# Altium schematic sheet 03.Schematic.SchDoc: Schematic Page
size A3; DrawnBy: My My; Revision: 1.1; SheetNumber: 3; SheetTotal: 4
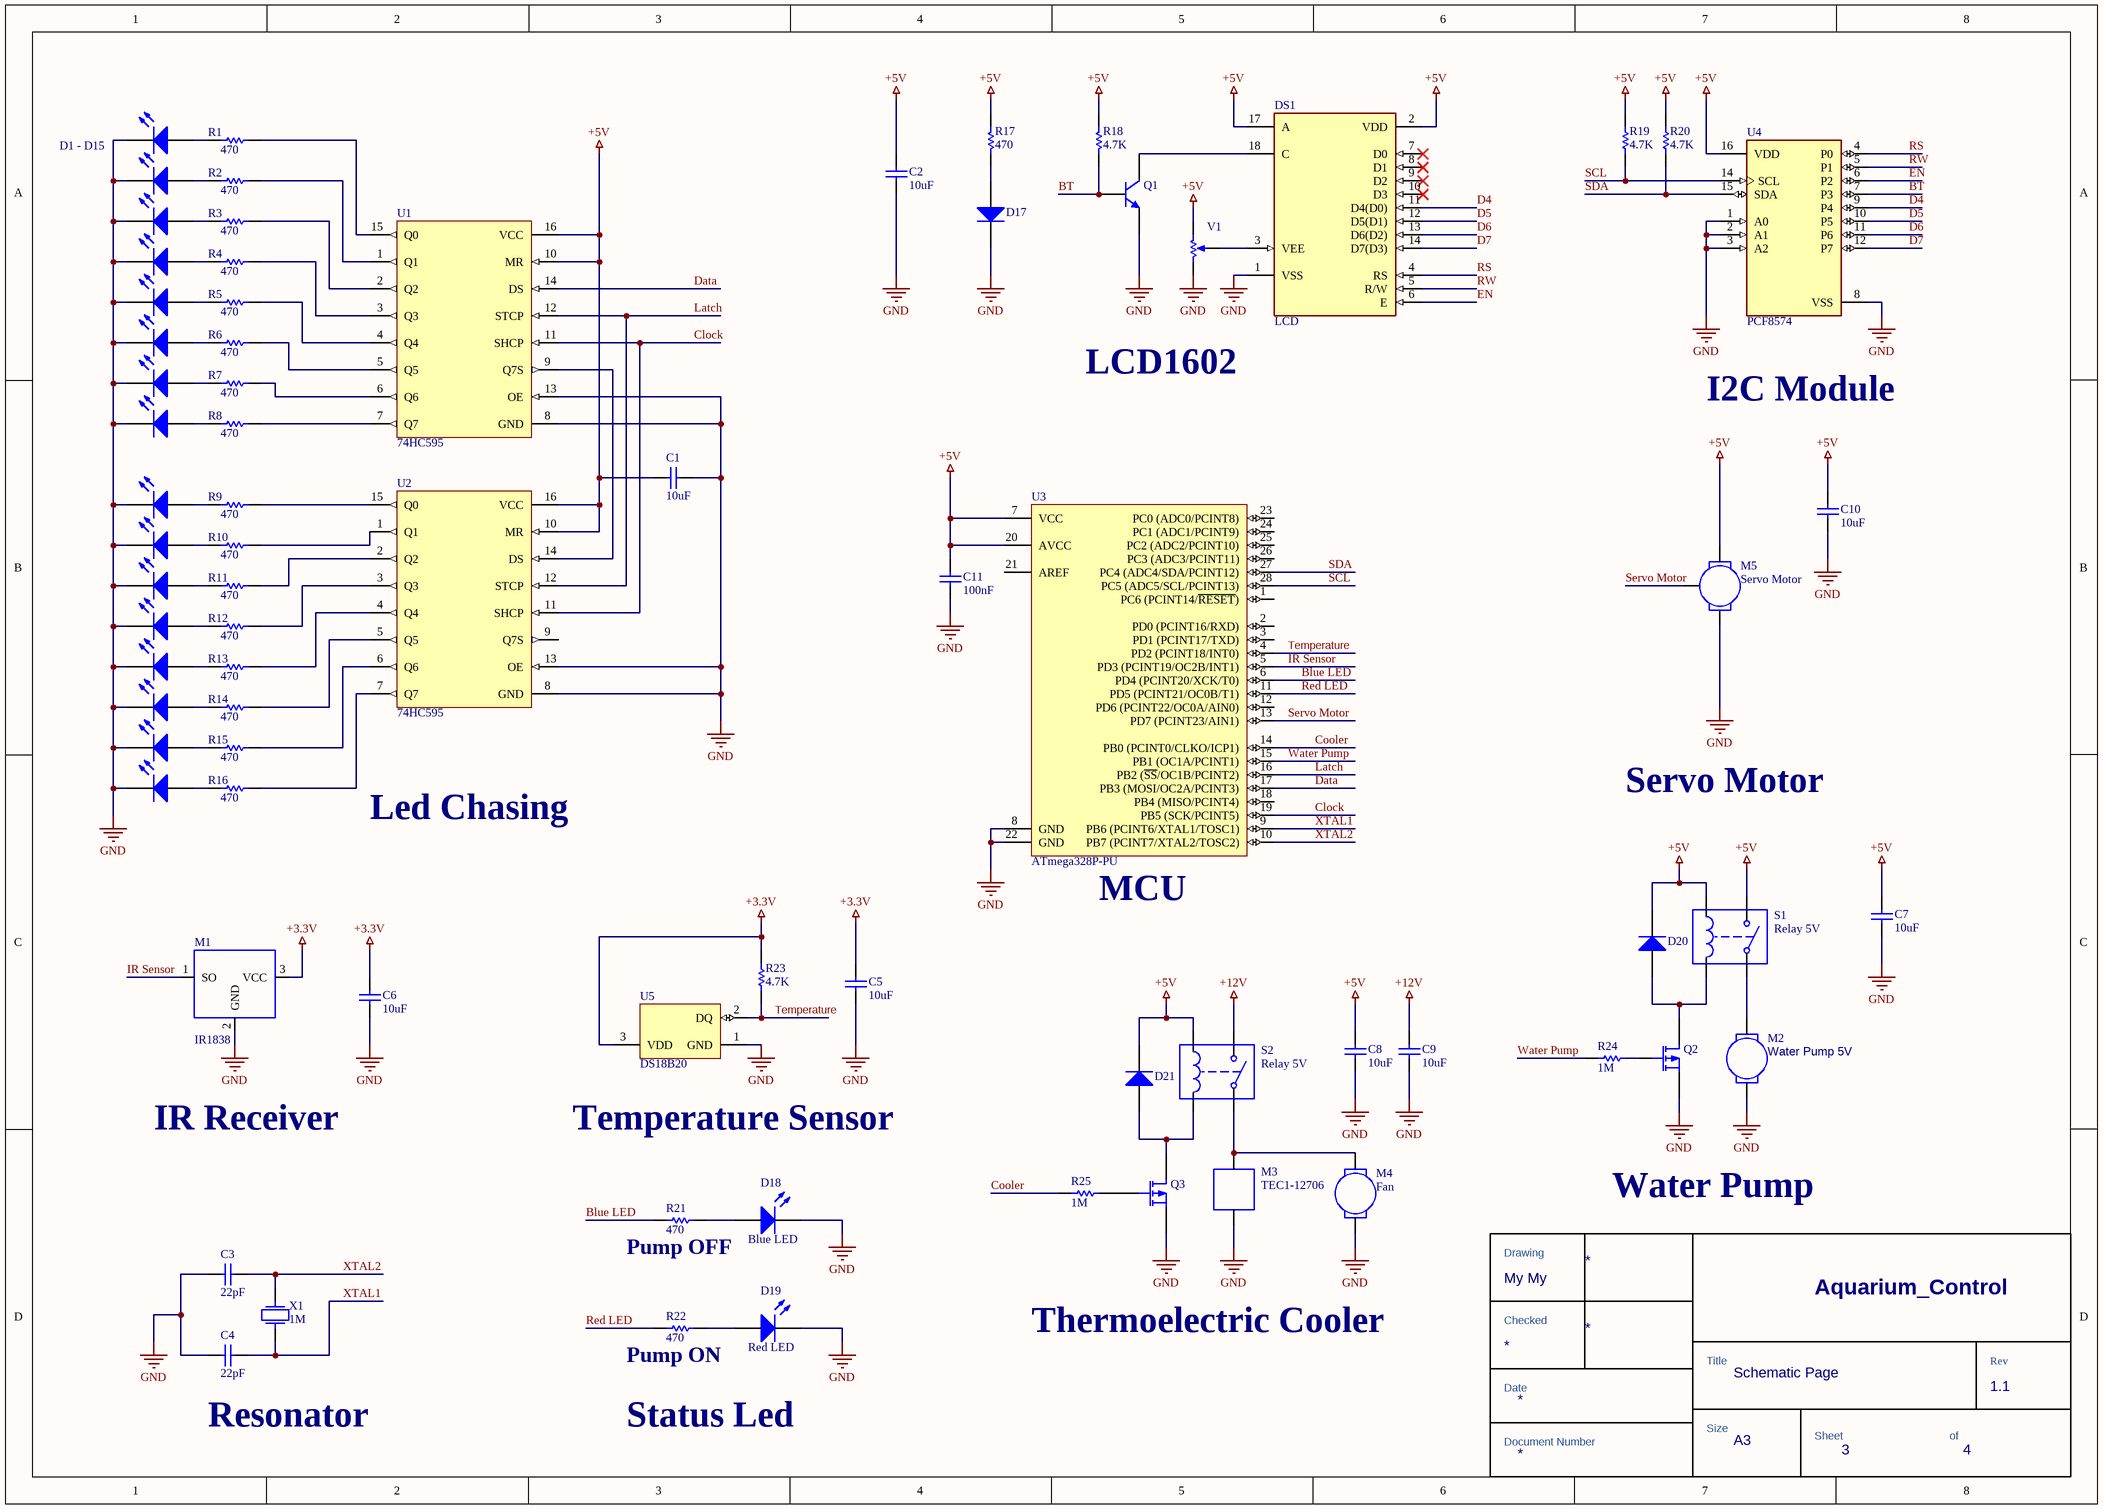
[diagram p0: 03.Schematic.SchDoc]

## Parts
*  TitleBlock  (value not drawn)  (graphical)
C1  value 10uF  (hidden comment: Capacitor)
C2  value 10uF  (hidden comment: Capacitor)
C3  value 22pF  (hidden comment: Capacitor)
C4  value 22pF  (hidden comment: Capacitor)
C5  value 10uF  (hidden comment: Capacitor)
C6  value 10uF  (hidden comment: Capacitor)
C7  value 10uF  (hidden comment: Capacitor)
C8  value 10uF  (hidden comment: Capacitor)
C9  value 10uF  (hidden comment: Capacitor)
C10  value 10uF  (hidden comment: Capacitor)
C11  value 100nF  (hidden comment: Capacitor)
D1  Light-Emitting Diode  (value not drawn)
D2  Light-Emitting Diode  (value not drawn)
D3  Light-Emitting Diode  (value not drawn)
D4  Light-Emitting Diode  (value not drawn)
D5  Light-Emitting Diode  (value not drawn)
D6  Light-Emitting Diode  (value not drawn)
D7  Light-Emitting Diode  (value not drawn)
D8  Light-Emitting Diode  (value not drawn)
D9  Light-Emitting Diode  (value not drawn)
D10  Light-Emitting Diode  (value not drawn)
D11  Light-Emitting Diode  (value not drawn)
D12  Light-Emitting Diode  (value not drawn)
D13  Light-Emitting Diode  (value not drawn)
D14  Light-Emitting Diode  (value not drawn)
D15  Light-Emitting Diode  (value not drawn)
D16  Light-Emitting Diode  (value not drawn)
D17  Diode  (value not drawn)
D18  Blue LED
D19  Red LED
D20  Diode  (value not drawn)
D21  Diode  (value not drawn)
DS1  LCD  [FP-EA_DIP162-DHNLED-MFG]
M1  IR1838
M2  Water Pump 5V
M3  TEC1-12706
M4  Fan
M5  Servo Motor
Q1  Bipolar NPN 3 Pins Transistor VBIC Model  (value not drawn)
Q2  P-channel Power MOSFET VDMOS Model  (value not drawn)
Q3  P-channel Power MOSFET VDMOS Model  (value not drawn)
R1  value 470  (hidden comment: Resistor)
R2  value 470  (hidden comment: Resistor)
R3  value 470  (hidden comment: Resistor)
R4  value 470  (hidden comment: Resistor)
R5  value 470  (hidden comment: Resistor)
R6  value 470  (hidden comment: Resistor)
R7  value 470  (hidden comment: Resistor)
R8  value 470  (hidden comment: Resistor)
R9  value 470  (hidden comment: Resistor)
R10  value 470  (hidden comment: Resistor)
R11  value 470  (hidden comment: Resistor)
R12  value 470  (hidden comment: Resistor)
R13  value 470  (hidden comment: Resistor)
R14  value 470  (hidden comment: Resistor)
R15  value 470  (hidden comment: Resistor)
R16  value 470  (hidden comment: Resistor)
R17  value 470  (hidden comment: Resistor)
R18  value 4.7K  (hidden comment: Resistor)
R19  value 4.7K  (hidden comment: Resistor)
R20  value 4.7K  (hidden comment: Resistor)
R21  value 470  (hidden comment: Resistor)
R22  value 470  (hidden comment: Resistor)
R23  value 4.7K  (hidden comment: Resistor)
R24  value 1M  (hidden comment: Resistor)
R25  value 1M  (hidden comment: Resistor)
S1  Relay 5V
S2  Single-Pole, Single-Throw Normally Opened Relay  (value not drawn)
U1  74HC595
U2  74HC595
U3  ATmega328P-PU  [28P3]
U4  PCF8574  [FP-SOT162-1-MFG]
U5  DS18B20  [Q3+1]
V1  Potentiometer  (value not drawn)
X1  F0: 1M  (hidden comment: Crystal)

## Nets
+3.3V: C5.2 C6.2 M1.3(VCC) R23.2 U5.3(VDD)
+5V: C1.1 C2.2 C7.2 C8.2 C10.2 C11.2 D20.2(K) D21.2(K) DS1.2(VDD) DS1.17(A) M5.1 R17.2 R18.2 R19.2 R20.2 S1.2 S1.4 S2.4 U1.10(MR) U1.16(VCC) U2.10(MR) U2.16(VCC) U3.7(VCC) U3.20(AVCC) U4.16(VDD) V1.1(TOP)
+12V: C9.2 S2.2
GND: C1.2 C2.1 C3.1 C4.1 C5.1 C6.1 C7.1 C8.1 C9.1 C10.1 C11.1 D1.2(K) D2.2(K) D3.2(K) D4.2(K) D5.2(K) D6.2(K) D7.2(K) D8.2(K) D9.2(K) D10.2(K) D11.2(K) D12.2(K) D13.2(K) D14.2(K) D15.2(K) D16.2(K) D17.2(K) D18.2(K) D19.2(K) DS1.1(VSS) M1.2(GND) M2.2 M3.2 M4.2 M5.1 Q1.3(E) Q2.3(S) Q3.3(S) U1.8(GND) U1.13(OE) U2.8(GND) U2.13(OE) U3.8(GND) U3.22(GND) U4.1(A0) U4.2(A1) U4.3(A2) U4.8(VSS) U5.1(GND) V1.2(BOT)
Blue LED: R21.1 U3.6(PD4_(PCINT20/XCK/T0))
BT: Q1.2(B) R18.1 U4.7(P3)
Clock: U1.11(SHCP) U2.11(SHCP) U3.19(PB5_(SCK/PCINT5))
Cooler: R25.1 U3.14(PB0_(PCINT0/CLKO/ICP1))
D4: DS1.11(D4(D0)) U4.9(P4)
D5: DS1.12(D5(D1)) U4.10(P5)
D6: DS1.13(D6(D2)) U4.11(P6)
D7: DS1.14(D7(D3)) U4.12(P7)
Data: U1.14(DS) U3.17(PB3_(MOSI/OC2A/PCINT3))
EN: DS1.6(E) U4.6(P2)
IR Sensor: M1.1(SO) U3.5(PD3_(PCINT19/OC2B/INT1))
Latch: U1.12(STCP) U2.12(STCP) U3.16(PB2_(~{SS}/OC1B/PCINT2))
Red LED: R22.1 U3.11(PD5_(PCINT21/OC0B/T1))
RS: DS1.4(RS) U4.4(P0)
RW: DS1.5(R/W) U4.5(P1)
SCL: R19.1 U3.28(PC5_(ADC5/SCL/PCINT13)) U4.14(SCL)
SDA: R20.1 U3.27(PC4_(ADC4/SDA/PCINT12)) U4.15(SDA)
Servo Motor: M5.1 U3.13(PD7_(PCINT23/AIN1))
Temperature: R23.1 U3.4(PD2_(PCINT18/INT0)) U5.2(DQ)
Water Pump: R24.1 U3.15(PB1_(OC1A/PCINT1))
XTAL1: C4.2 U3.9(PB6_(PCINT6/XTAL1/TOSC1)) X1.1
XTAL2: C3.2 U3.10(PB7_(PCINT7/XTAL2/TOSC2)) X1.2
NetD1_1: D1.1(A) R1.2
NetD2_1: D2.1(A) R2.2
NetD3_1: D3.1(A) R3.2
NetD4_1: D4.1(A) R4.2
NetD5_1: D5.1(A) R5.2
NetD6_1: D6.1(A) R6.2
NetD7_1: D7.1(A) R7.2
NetD8_1: D8.1(A) R8.2
NetD9_1: D9.1(A) R9.2
NetD10_1: D10.1(A) R10.2
NetD11_1: D11.1(A) R11.2
NetD12_1: D12.1(A) R12.2
NetD13_1: D13.1(A) R13.2
NetD14_1: D14.1(A) R14.2
NetD15_1: D15.1(A) R15.2
NetD16_1: D16.1(A) R16.2
NetD17_1: D17.1(A) R17.1
NetD18_1: D18.1(A) R21.2
NetD19_1: D19.1(A) R22.2
NetD20_1: D20.1(A) Q2.1(D) S1.3
NetD21_1: D21.1(A) Q3.1(D) S2.3
NetDS1_3: DS1.3(VEE) V1.3(TAP)
NetDS1_18: DS1.18(C) Q1.1(C)
NetM2_1: M2.1 S1.1
NetM3_1: M3.1 M4.1 S2.1
NetQ2_2: Q2.2(G) R24.2
NetQ3_2: Q3.2(G) R25.2
NetR1_1: R1.1 U1.15(Q0)
NetR2_1: R2.1 U1.1(Q1)
NetR3_1: R3.1 U1.2(Q2)
NetR4_1: R4.1 U1.3(Q3)
NetR5_1: R5.1 U1.4(Q4)
NetR6_1: R6.1 U1.5(Q5)
NetR7_1: R7.1 U1.6(Q6)
NetR8_1: R8.1 U1.7(Q7)
NetR9_1: R9.1 U2.15(Q0)
NetR10_1: R10.1 U2.1(Q1)
NetR11_1: R11.1 U2.2(Q2)
NetR12_1: R12.1 U2.3(Q3)
NetR13_1: R13.1 U2.4(Q4)
NetR14_1: R14.1 U2.5(Q5)
NetR15_1: R15.1 U2.6(Q6)
NetR16_1: R16.1 U2.7(Q7)
NetU1_9: U1.9(Q7S) U2.14(DS)

Not connected (* = marked no-connect by the designer): DS1 7(D0)* 8(D1)* 9(D2)* 10(D3)* 15(NC) 16(NC); U2 9(Q7S); U3 1(PC6_(PCINT14/~{RESET})) 2(PD0_(PCINT16/RXD)) 3(PD1_(PCINT17/TXD)) 12(PD6_(PCINT22/OC0A/AIN0)) 18(PB4_(MISO/PCINT4)) 21(AREF) 23(PC0_(ADC0/PCINT8)) 24(PC1_(ADC1/PCINT9)) 25(PC2_(ADC2/PCINT10)) 26(PC3_(ADC3/PCINT11)); U4 13(~{INT})

## Notes on the sheet
- D1 - D15
- LCD1602
- I2C Module
- Led Chasing
- Servo Motor
- (near U3) MCU
- (near S2) Relay 5V
- IR Receiver
- Temperature Sensor
- (near R21) Pump OFF
- Water Pump
- (near R22) Pump ON
- Thermoelectric Cooler
- (near C4) Resonator
- Status Led
- (in symbol TitleBlock) Drawing; Aquarium_Control; Checked; Title; Rev; Date; Size; Sheet; of; Document Number; A3

## Library data of the parts
* = TitleBlock: Common Title Block
C1-C11 = Capacitor: SimulationGenericComponent: True
D1-D16 = LED: AF: 1; BV: 0; BV_MAX: 1e99; EG: 1.11; FC: 0.5; IBV: 0.001; IS: 1e-14; MJSW: 0.33; NTUN: 30; TNOM: 27; XTI: 3; SimulationGenericComponent: True; CJO: 0; CJP: 0; CTA: 0; CTP: 0; FCS: 0.5; FV_MAX: 1e99; IKF: 0; IKR: 0; ISR: 1e-14; JSW: 0; JTUN: 0; JTUNSW: 0; KEG: 1; KF: 0; LEVEL: 1; N: 1; NBV: 1; NR: 1; NS: 1; PHP: 1; RS: 0; TCV: 0; TLEV: 0; TLEVC: 0; TM1: 0; TM2: 0; TPB: 0; TPHP: 0; TRS: 0; TRS2: 0; TT: 0; TTT1: 0; TTT2: 0; VJ: 1; XTITUN: 3
D17 D20 D21 = Diode: AF: 1; BV: 0; BV_MAX: 1e99; EG: 1.11; FC: 0.5; IBV: 0.001; ISR: 1e-14; MJSW: 0.33; NTUN: 30; TNOM: 27; XTI: 3; SimulationGenericComponent: True; CJO: 0; CJP: 0; CTA: 0; CTP: 0; FCS: 0.5; FV_MAX: 1e99; IKF: 0; IKR: 0; JSW: 0; JTUN: 0; JTUNSW: 0; KEG: 1; KF: 0; LEVEL: 1; N: 1; NBV: 1; NR: 1; NS: 1; PHP: 1; RS: 0; TCV: 0; TLEV: 0; TLEVC: 0; TM1: 0; TM2: 0; TPB: 0; TPHP: 0; TRS: 0; TRS2: 0; TT: 0; TTT1: 0; TTT2: 0; VJ: 1; XTITUN: 3; IS: 1e-14
D18 D19 = LED: Light-Emitting Diode; AF: 1; BV: 0; BV_MAX: 1e99; EG: 1.11; FC: 0.5; IBV: 0.001; IS: 1e-14; MJSW: 0.33; NTUN: 30; TNOM: 27; XTI: 3; SimulationGenericComponent: True; CJO: 0; CJP: 0; CTA: 0; CTP: 0; FCS: 0.5; FV_MAX: 1e99; IKF: 0; IKR: 0; ISR: 1e-14; JSW: 0; JTUN: 0; JTUNSW: 0; KEG: 1; KF: 0; LEVEL: 1; N: 1; NBV: 1; NR: 1; NS: 1; PHP: 1; RS: 0; TCV: 0; TLEV: 0; TLEVC: 0; TM1: 0; TM2: 0; TPB: 0; TPHP: 0; TRS: 0; TRS2: 0; TT: 0; TTT1: 0; TTT2: 0; VJ: 1; XTITUN: 3
DS1 = CMP-140401-000001-1: LCD MOD CHAR 2X16 Y/G BACKLIT; Manufacturer Part Number: EA DIP162-DHNLED; Manufacturer: Display Visions; Number Of Characters: 32; Min Supply Voltage: 2.7V; Max Supply Voltage: 5V; Interface: Parallel; Colour: Yellow/Green; Temperature Range High: +70°C; Device Class L2: Displays; Height: 11mm; Device Class L3: LCD; Display Type: LCD; Package: EA DIP162-DHNLED; Lead Free: Yes; Digikey Description: LCD MOD CHAR 2X16 Y/G BACKLIT; RoHS: TRUE; Device Class L1: Optoelectronics; Automotive: No; ComponentLink2Description: Datasheet; Octopart: https://octopart.com/ea+dip162-dhnled-display+visions-99339882; Temperature Range Low: -20°C; Category: Disp; Temperature: -20°C to +70°C; ComponentLink2URL: https://www.lcd-module.de/fileadmin/eng/pdf/doma/dip162-de.pdf
M2 = DC Motor: LA: 1.5M; RA: 0.5; KE: 0.05; JM: 250U; BM: 0.1M; TL: 0; SimulationGenericComponent: True; KT: 0.05
Q1 = BJT NPN VBIC: SimulationGenericComponent: True; AFN: 1; AJC: -0.5; ART: 0.1; AVC1: 0; EA: 1.12; FC: 0.9; IBBE: 1e-06; IBCI: 1e-16; IBEI: 1e-18; MC: 0.33; NCN: 2; NKF: 0.5; PC: 0.75; TNOM: 27; VERS: 1.2; XII: 3; AJE: -0.5; AJS: -0.5; AVC2: 0; BFN: 1; CBCO: 0; CBEO: 0; CCSO: 0; CJC: 0; CJCP: 0; CJE: 0; CJEP: 0; CTH: 0; DEAR: 0; EAIC: 1.12; EAIE: 1.12; EAIS: 1.12; EANC: 1.12; EANE: 1.12; EANS: 1.12; EAP: 1.12; EBBE: 0; GAMM: 0; HRCF: 1; IBCIP: 0; IBCN: 0; IBCNP: 0; IBEIP: 0; IBEN: 0; IBENP: 0; IKF: 0; IKP: 0; IKR: 0; IS: 1e-16; ISP: 0; ISRR: 1; ITF: 0; KFN: 0; ME: 0.33; MS: 0.33; NBBE: 1; NCI: 1; NCIP: 1; NCNP: 2; NEI: 1; NEN: 2; NF: 1; NFP: 1; NR: 1; PE: 0.75; PS: 0.75; QBM: 0; QCO: 0; QTF: 0; RBI: 0.1; RBP: 0.1; RBX: 0; RCI: 0.1; RCX: 0; RE: 0; RS: 0; RTH: 0; TAVC: 0; TD: 0; TF: 0; TNBBE: 0; TNF: 0; TR: 0; TVBBE1: 0; TVBBE2: 0; VBBE: 0; VEF: 0; VER: 0; VO: 0; VREF: 0; VRT: 0; VTF: 0; WBE: 1; WSP: 1; XIKF: 0; XIN: 3; XIS: 3; XISR: 0; XRBI: 0; XRBP: 0; XRBX: 0; XRCI: 0; XRCX: 0; XRE: 0; XRS: 0; XTF: 0; XVO: 0
Q2 Q3 = MOSFET P-ch VDMOS: XTI: 0; A: 1; BV: 1e30; EG: 1.11; FC: 0.5; IBV: 1e-10; IS: 1e-14; PHI: 0.6; TNOM: 27; VJ: 0.8; SimulationGenericComponent: True; CGDMAX: 0; CGDMIN: 0; CGS: 0; CJO: 0; KP: 1; KSUBTHRES: 0; LAMBDA: 0; M: 0.5; MTRIODE: 1; N: 1; NBV: 1; NCHAN: 1; PCHAN: 1; RB: 0; RD: 0; RDS: 1e30; RG: 0; RQ: 0; RS: 0; SUBSHIFT: 0; SUBSLOPE: 0; THETA: 0; TT: 0; VQ: 0; VTO: 0
R1-R25 = Resistor: TC1: 0; SimulationGenericComponent: True; TC2: 0
S1 = SPST Relay NO: Single-Pole, Single-Throw Normally Opened Relay; L_C: 1u; R_C: 100; RON: 1; ROFF: 1e12; ION: 1m; IOFF: 0; SimulationGenericComponent: True
S2 = SPST Relay NO: L_C: 1u; R_C: 100; RON: 1; ROFF: 1e12; ION: 1m; IOFF: 0; SimulationGenericComponent: True
U3 = CMP-0095-00013-2: 8-bit AVR Microcontroller, 32KB Flash, 1KB EEPROM, 2KB SRAM, 28-pin PDIP, Industrial Grade (-40°C to 85°C); RevisionNote: DatasheetVersion updated. URLs added.; PackageVersion: revB, Sep-2001; PackageDescription: 28-lead (0.300"/7.62mm Wide) Plastic Dual Inline Package (PDIP); DatasheetVersion: revD, May-2011; ComponentLink1Description: Manufacturer URL; ComponentLink1URL: http://www.atmel.com/; PackageReference: 28P3; ComponentLink2Description: ATmega48A/48PA/88A/88PA/168A/168PA/328/328P Datasheet; ComponentLink3URL: http://www.atmel.com/dyn/resources/prod_documents/8271S.pdf; ComponentLink2URL: http://www.atmel.com/dyn/resources/prod_documents/8271.pdf; ComponentLink3Description: ATmega48A/48PA/88A/88PA/168A/168PA/328/328P Summary
U4 = CMP-10112-000010-1: IC I/O EXPANDER I2C 8B 16SOIC; Manufacturer Part Number: PCF8574T/3,518; Manufacturer: NXP Semiconductors; Frequency: 100kHz; Max Supply Voltage: 6V; Standoff Height: 0.1mm; Nominal Supply Current: 40uA; Max Junction Temp: +125°C; Min Supply Voltage: 2.5V; Number Of I/Os: 8; Footprint Url: https://www.nxp.com/docs/en/package-information/SOT162-1.pdf; ComponentLink2URL: https://www.nxp.com/docs/en/data-sheet/PCF8574_PCF8574A.pdf; Automotive: No; Digikey Description: IC I/O EXPANDER I2C 8B 16SOIC; Mouser Description: PCF8574 Series 2.5 - 6V Remote 8-bit I/O Expander for I2C-bus - SOIC-16; Ipc Land Pattern Name: SOIC127P1032X265-16; Interface: I2C; Octopart: https://octopart.com/pcf8574t%2F3%2C518-nxp+semiconductors-10470852; Ambient Temperature Range Low: -40°C; Lead Free: Yes; Device Class L2: Interface ICs; Temperature Range High: +85°C; Device Class L1: Integrated Circuits (ICs); Package: SOT162-1; ComponentLink2Description: Datasheet; Device Class L3: I/O Expanders; Temperature: -40°C to +85°C; Ambient Temperature Range High: +85°C; Height: 2.65mm; Category: IC; RoHS: TRUE; Temperature Range Low: -40°C
U5 = CMP-0253-00003-1: Programmable Resolution Digital Thermometer, 1-Wire Interface, ±0.5°C Accuracy, 3-Pin TO92, -55°C to +125°C, Pb-Free; ComponentLink2URL: http://datasheets.maxim-ic.com/en/ds/DS18B20.pdf; PackageReference: Q3+1; ComponentLink1Description: Manufacturer URL; PackageDescription: TO-92 Package, Body Dia. 4.7mm; Leads 0.51 x 0.51 mm (max), Pb-Free; DatasheetVersion: 2007; Code_JEDEC: TO-226-AA; ComponentLink1URL: http://www.maxim-ic.com; PackageVersion: revB, 2009; ComponentLink2Description: Datasheet
V1 = Potentiometer: value: 1k; position: 0.5; SimulationGenericComponent: True
X1 = Crystal: R: 500; Q: 50K; SimulationGenericComponent: True